# Altium schematic sheet [01] - sheet_connector.SchDoc
size A4
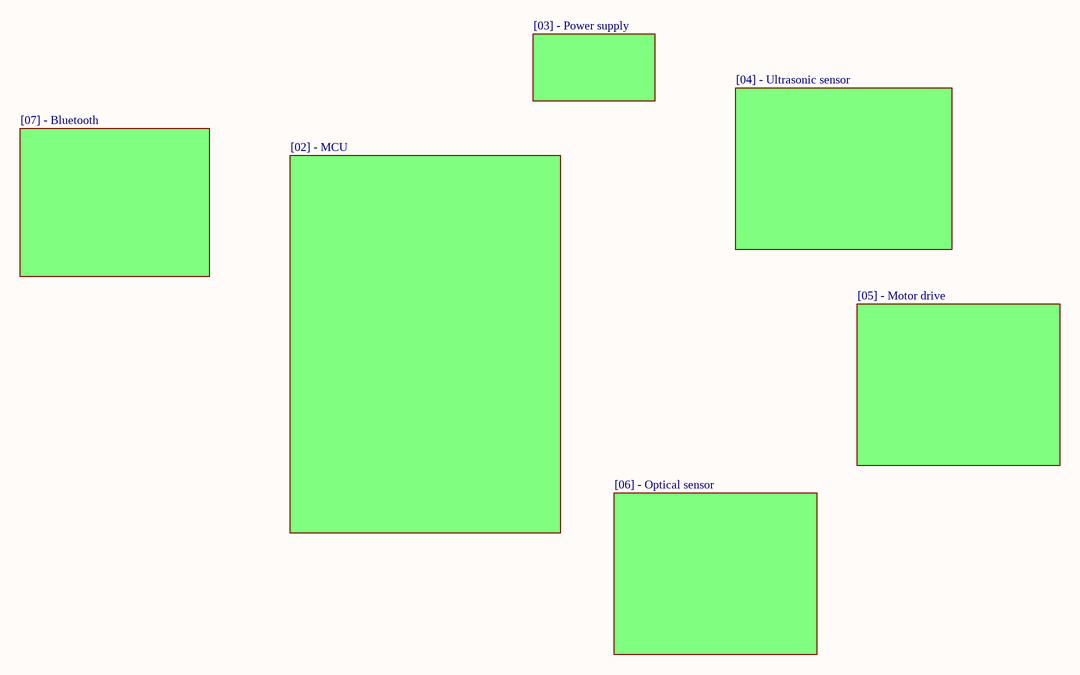
[diagram p0: [01] - sheet_connector.SchDoc]

## Sub-sheets
Designator = [02] - MCU: no entries
Designator = [04] - Ultrasonic sensor: no entries
Designator = [05] - Motor drive: no entries
Designator = [07] - Bluetooth: no entries
Designator = [06] - Optical sensor: no entries
Designator = [03] - Power supply: no entries

## Notes on the sheet
- Title
- Size:
- Date:
- A4
- Number:
- Time:
- Revision:
- Sheet
- of
- File: